# Altium schematic sheet Main.SchDoc
size A4; SheetNumber: 1; SheetTotal: 12
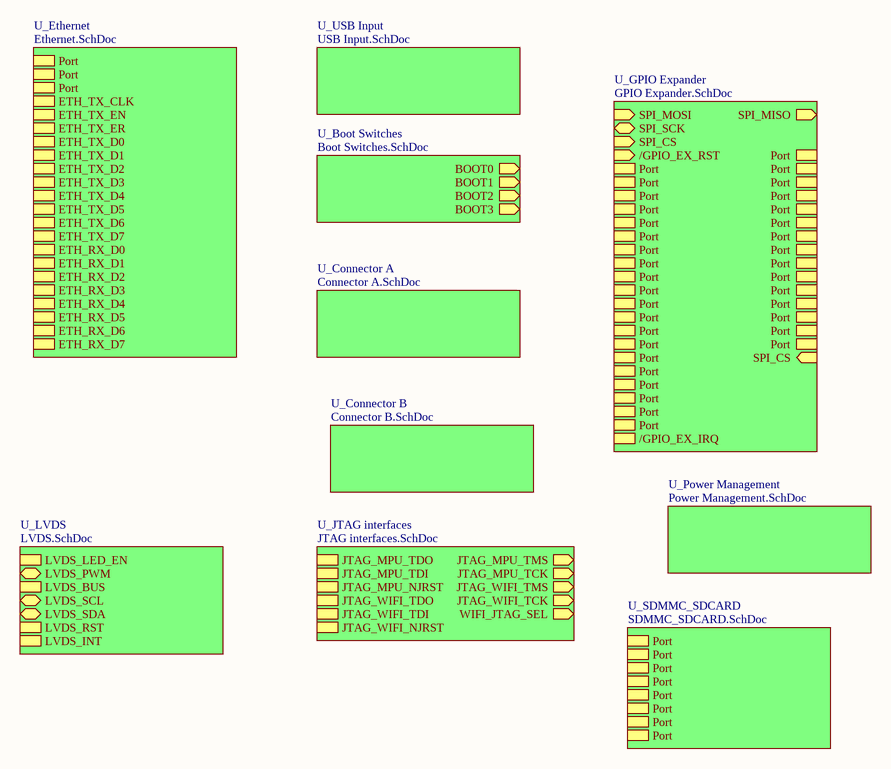
[diagram p0: Main.SchDoc]

## Sub-sheets
U_Boot Switches = Boot Switches.SchDoc: BOOT0 (out), BOOT1 (out), BOOT2 (out), BOOT3 (out)
U_Connector A = Connector A.SchDoc: no entries
U_Connector B = Connector B.SchDoc: no entries
U_Ethernet = Ethernet.SchDoc: Port, Port, Port, ETH_TX_CLK, ETH_TX_EN, ETH_TX_ER, ETH_TX_D0, ETH_TX_D1, ETH_TX_D2, ETH_TX_D3, ETH_TX_D4, ETH_TX_D5, ETH_TX_D6, ETH_TX_D7, ETH_RX_D0, ETH_RX_D1, ETH_RX_D2, ETH_RX_D3, ETH_RX_D4, ETH_RX_D5, ETH_RX_D6, ETH_RX_D7
U_GPIO Expander = GPIO Expander.SchDoc: SPI_MOSI (in), SPI_MISO (out), SPI_SCK (bidir), SPI_CS (in), /GPIO_EX_RST (in), Port, Port, Port, Port, Port, Port, Port, Port, Port, Port, Port, Port, Port, Port, Port, Port, Port, Port, Port, Port, /GPIO_EX_IRQ, Port, Port, Port, Port, Port, Port, Port, Port, Port, Port, Port, Port, Port, Port, Port, SPI_CS (in)
U_JTAG interfaces = JTAG interfaces.SchDoc: JTAG_MPU_TMS (out), JTAG_MPU_TCK (out), JTAG_MPU_TDO, JTAG_MPU_TDI, JTAG_MPU_NJRST, JTAG_WIFI_TMS (out), JTAG_WIFI_TCK (out), JTAG_WIFI_TDO, JTAG_WIFI_TDI, JTAG_WIFI_NJRST, WIFI_JTAG_SEL (out)
U_LVDS = LVDS.SchDoc: LVDS_LED_EN, LVDS_PWM (bidir), LVDS_BUS (harness LVDS_CONNECTOR), LVDS_SCL (bidir), LVDS_SDA (bidir), LVDS_RST, LVDS_INT
U_Power Management = Power Management.SchDoc: no entries
U_SDMMC_SDCARD = SDMMC_SDCARD.SchDoc: Port, Port, Port, Port, Port, Port, Port, Port
U_USB Input = USB Input.SchDoc: no entries